# Altium schematic sheet MAX96717_PINOUT.SchDoc
size C; SheetNumber: 3; SheetTotal: 3
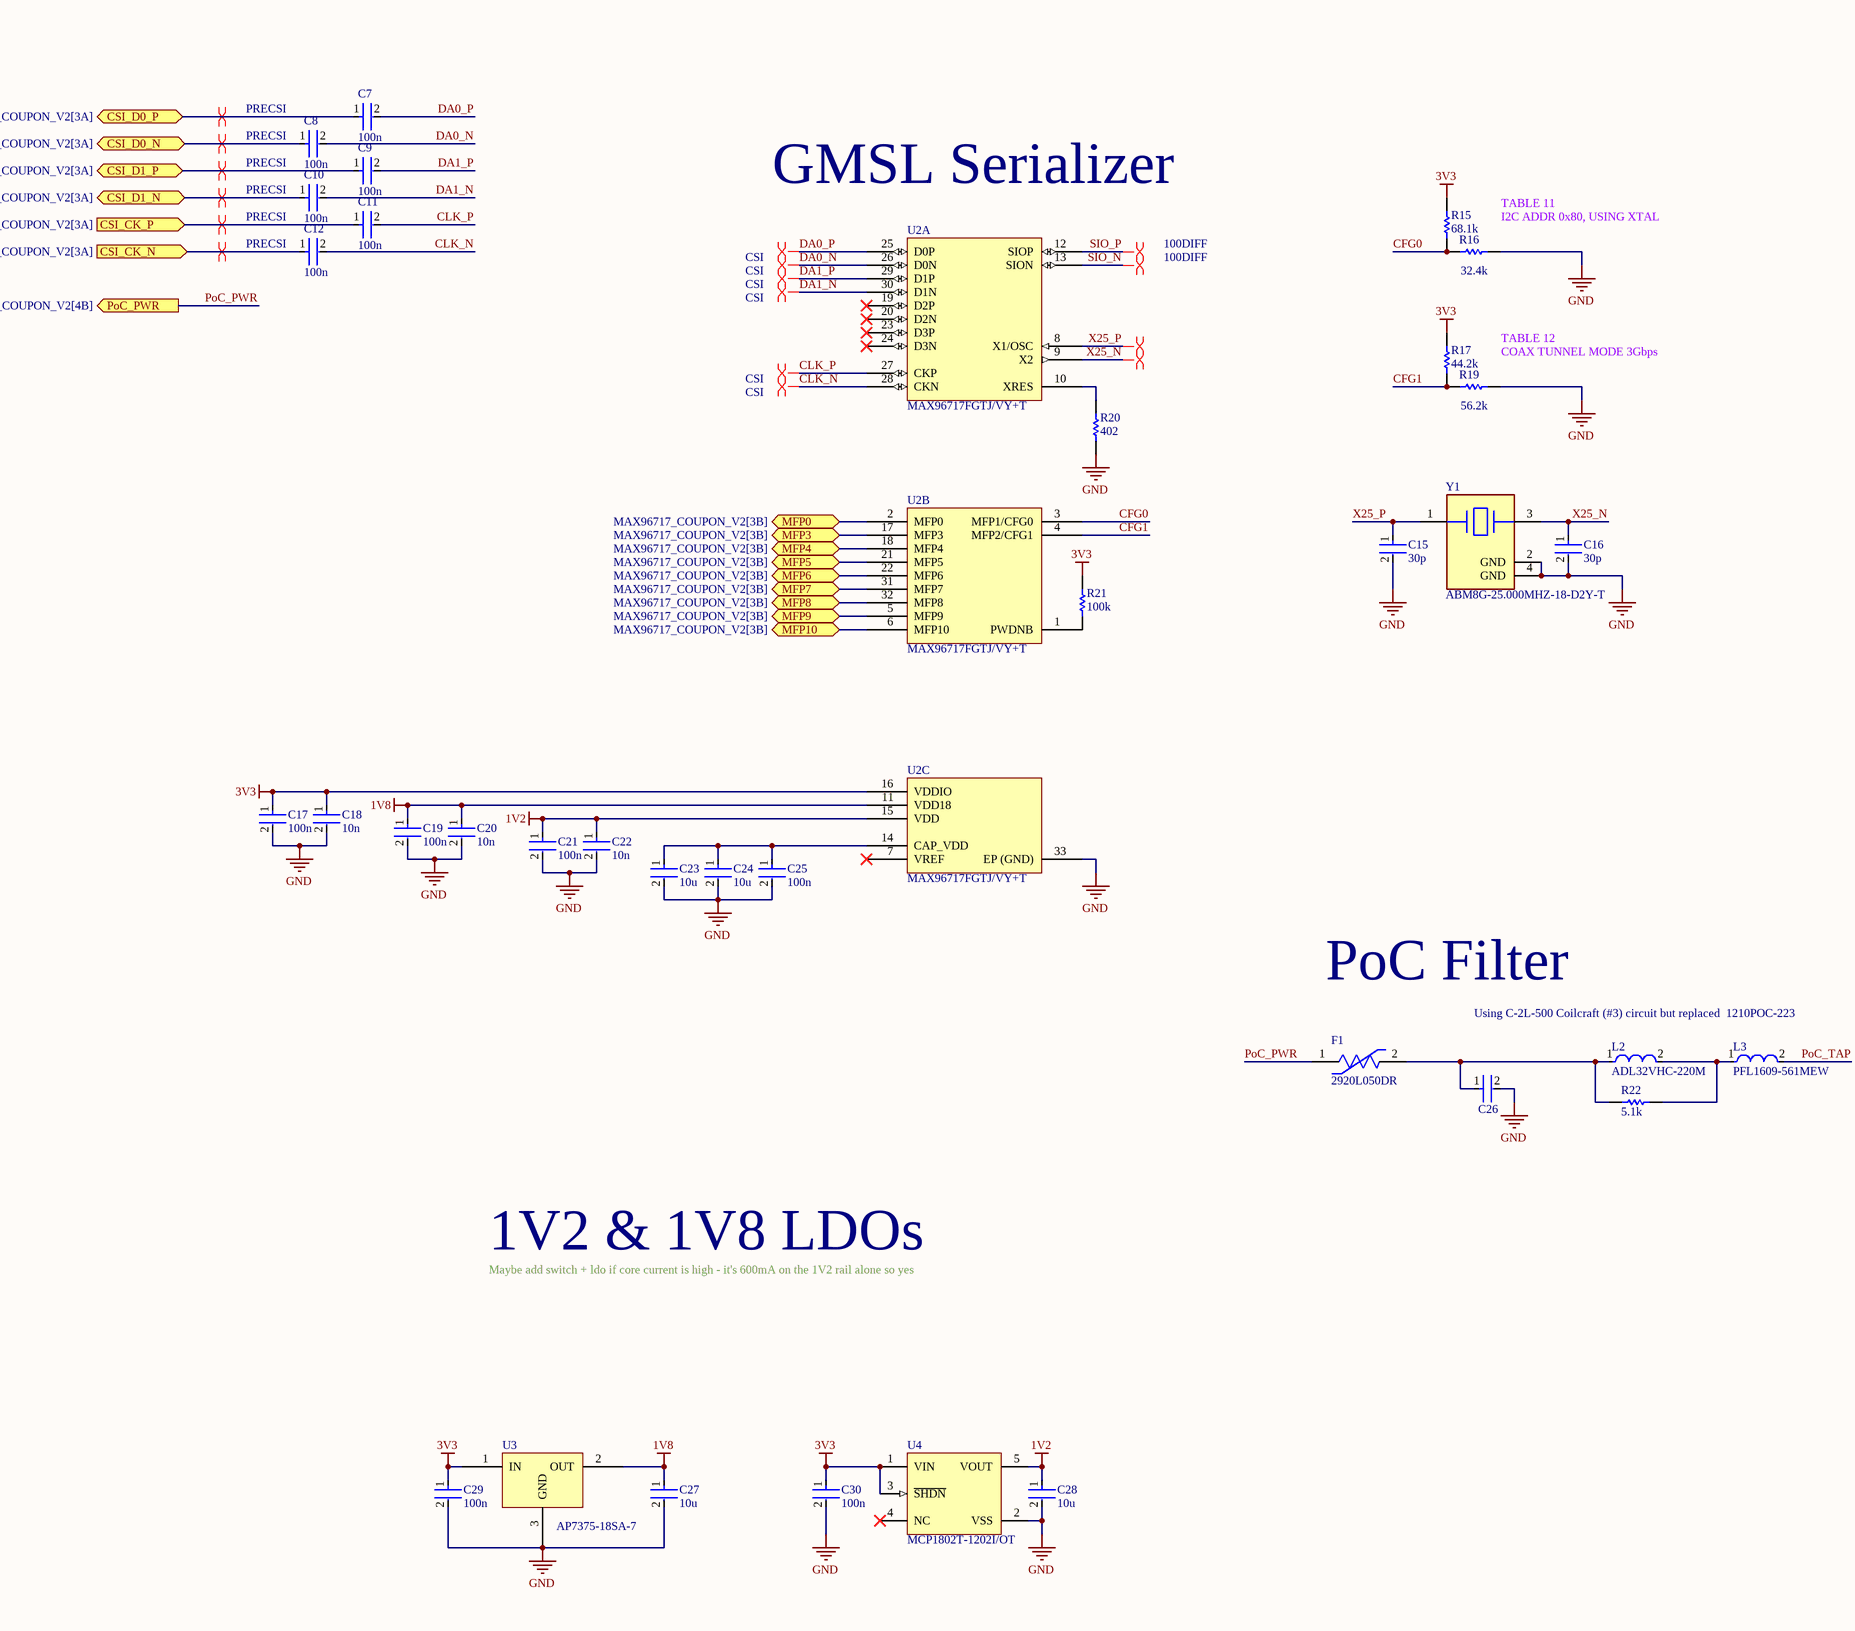
[diagram p0: MAX96717_PINOUT.SchDoc, left]
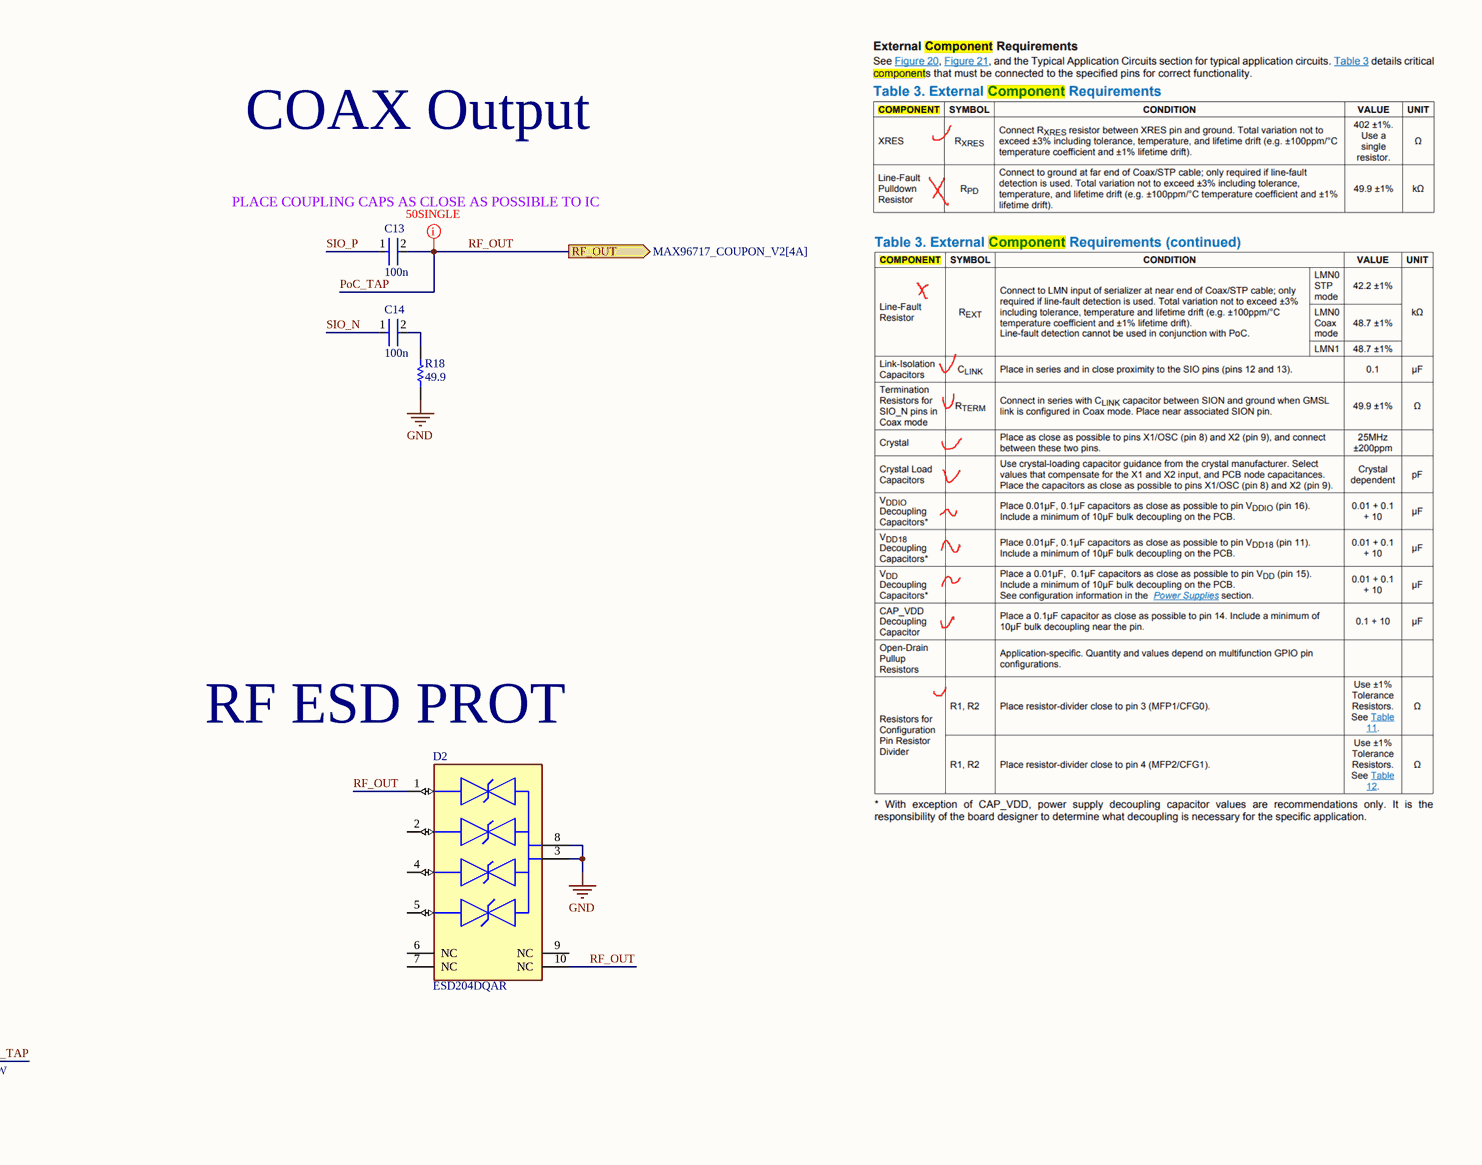
[diagram p1: MAX96717_PINOUT.SchDoc, right]

## Parts
C7  100n  [FP-0402-L_1_0_0_05-W_0_5-IPC_A]
C8  100n  [FP-0402-L_1_0_0_05-W_0_5-IPC_A]
C9  100n  [FP-0402-L_1_0_0_05-W_0_5-IPC_A]
C10  100n  [FP-0402-L_1_0_0_05-W_0_5-IPC_A]
C11  100n  [FP-0402-L_1_0_0_05-W_0_5-IPC_A]
C12  100n  [FP-0402-L_1_0_0_05-W_0_5-IPC_A]
C13  100n  [FP-0402-L_1_0_0_05-W_0_5-IPC_A]
C14  100n  [FP-0402-L_1_0_0_05-W_0_5-IPC_A]
C15  30p  [FP-0402-L_1_0_0_05-W_0_5-IPC_A]
C16  30p  [FP-0402-L_1_0_0_05-W_0_5-IPC_A]
C17  100n  [FP-0402-L_1_0_0_05-W_0_5-IPC_A]
C18  10n  [FP-0402-L_1_0_0_05-W_0_5-IPC_A]
C19  100n  [FP-0402-L_1_0_0_05-W_0_5-IPC_A]
C20  10n  [FP-0402-L_1_0_0_05-W_0_5-IPC_A]
C21  100n  [FP-0402-L_1_0_0_05-W_0_5-IPC_A]
C22  10n  [FP-0402-L_1_0_0_05-W_0_5-IPC_A]
C23  10u  [FP-0402-L_1_0_0_05-W_0_5-IPC_A]
C24  10u  [FP-0402-L_1_0_0_05-W_0_5-IPC_A]
C25  100n  [FP-0402-L_1_0_0_05-W_0_5-IPC_A]
C26  GRM21BR61E226ME44L  [FP-GRM21B-0_2-e0_2_0_7-IPC_B]  (value not drawn)
C27  10u  [FP-0402-L_1_0_0_05-W_0_5-IPC_A]
C28  10u  [FP-0402-L_1_0_0_05-W_0_5-IPC_A]
C29  100n  [FP-0402-L_1_0_0_05-W_0_5-IPC_A]
C30  100n  [FP-0402-L_1_0_0_05-W_0_5-IPC_A]
D2  ESD204DQAR  [FP-DQA0010A-MFG]
F1  2920L050DR  [FP-2920L050DR-MFG]
L2  ADL32VHC-220M  [FP-1210POC-MFG]
L3  PFL1609-561MEW  [FP-PFL1609-MFG]
R15  68.1k  [R0603B]
R16  32.4k  [R0603B]
R17  44.2k  [R0603B]
R18  49.9  [R0603B]
R19  56.2k  [R0603B]
R20  402  [R0603B]
R21  100k  [R0603B]
R22  5.1k  [R0603B]
U2  MAX96717FGTJ/VY+T  [QFN50P500X500X80_HS-33N]  (parts A,B,C of 3)
U3  AP7375-18SA-7  [AP7375-18SA-7-Footprint-1]
U4  MCP1802T-1202I/OT  [SOT-23-OT5_M]
Y1  ABM8G-25.000MHZ-18-D2Y-T  [FP-ABM8G-MFG]

## Ports
CSI_CK_N (in, see MAX96717_COUPON_V2[3A]), CSI_CK_P (in, see MAX96717_COUPON_V2[3A]), CSI_D0_N (bidir, see MAX96717_COUPON_V2[3A]), CSI_D0_P (bidir, see MAX96717_COUPON_V2[3A]), CSI_D1_N (bidir, see MAX96717_COUPON_V2[3A]), CSI_D1_P (bidir, see MAX96717_COUPON_V2[3A]), MFP0 (bidir, see MAX96717_COUPON_V2[3B]), MFP3 (bidir, see MAX96717_COUPON_V2[3B]), MFP4 (bidir, see MAX96717_COUPON_V2[3B]), MFP5 (bidir, see MAX96717_COUPON_V2[3B]), MFP6 (bidir, see MAX96717_COUPON_V2[3B]), MFP7 (bidir, see MAX96717_COUPON_V2[3B]), MFP8 (bidir, see MAX96717_COUPON_V2[3B]), MFP9 (bidir, see MAX96717_COUPON_V2[3B]), MFP10 (bidir, see MAX96717_COUPON_V2[3B]), PoC_PWR (out, see MAX96717_COUPON_V2[4B]), RF_OUT (out, see MAX96717_COUPON_V2[4A])

## Nets
1V2: C21.1 C22.1 C28.1 U2.15(VDD) U4.5(VOUT)
1V8: C19.1 C20.1 C27.1 U2.11(VDD18) U3.2(OUT)
3V3: C17.1 C18.1 C29.1 C30.1 R15.2 R17.2 R21.2 U2.16(VDDIO) U3.1(IN) U4.1(VIN) U4.3(~{SHDN})
GND: C15.2 C16.2 C17.2 C18.2 C19.2 C20.2 C21.2 C22.2 C23.2 C24.2 C25.2 C26.2 C27.2 C28.2 C29.2 C30.2 D2.3(GND) D2.8(GND) R16.1 R18.1 R19.1 R20.1 U2.33(EP_(GND)) U3.3(GND) U4.2(VSS) Y1.2(GND) Y1.4(GND)
CFG0: R15.1 R16.2 U2.3(MFP1/CFG0)
CFG1: R17.1 R19.2 U2.4(MFP2/CFG1)
CLK_N: C12.2 U2.28(CKN)
CLK_P: C11.2 U2.27(CKP)
CSI_CK_N: C12.1 ; port CSI_CK_N
CSI_CK_P: C11.1 ; port CSI_CK_P
CSI_D0_N: C8.1 ; port CSI_D0_N
CSI_D0_P: C7.1 ; port CSI_D0_P
CSI_D1_N: C10.1 ; port CSI_D1_N
CSI_D1_P: C9.1 ; port CSI_D1_P
DA0_N: C8.2 U2.26(D0N)
DA0_P: C7.2 U2.25(D0P)
DA1_N: C10.2 U2.30(D1N)
DA1_P: C9.2 U2.29(D1P)
MFP0: U2.2(MFP0) ; port MFP0
MFP3: U2.17(MFP3) ; port MFP3
MFP4: U2.18(MFP4) ; port MFP4
MFP5: U2.21(MFP5) ; port MFP5
MFP6: U2.22(MFP6) ; port MFP6
MFP7: U2.31(MFP7) ; port MFP7
MFP8: U2.32(MFP8) ; port MFP8
MFP9: U2.5(MFP9) ; port MFP9
MFP10: U2.6(MFP10) ; port MFP10
PoC_PWR: F1.1 ; port PoC_PWR
PoC_TAP: C13.2 D2.1(IO1) D2.10(NC) L3.2 ; port RF_OUT  [also labelled RF_OUT]
SIO_N: C14.1 U2.13(SION)
SIO_P: C13.1 U2.12(SIOP)
X25_N: C16.1 U2.9(X2) Y1.3
X25_P: C15.1 U2.8(X1/OSC) Y1.1
NetC14_2: C14.2 R18.2
NetC23_1: C23.1 C24.1 C25.1 U2.14(CAP_VDD)
NetC26_1: C26.1 F1.2 L2.1 R22.2
NetL2_2: L2.2 L3.1 R22.1
NetR20_2: R20.2 U2.10(XRES)
NetR21_1: R21.1 U2.1(PWDNB)

Not connected (* = marked no-connect by the designer): D2 2(IO2) 4(IO3) 5(IO4) 6(NC) 7(NC) 9(NC); U2 7(VREF)* 19(D2P)* 20(D2N)* 23(D3P)* 24(D3N)*; U4 4(NC)*

## Layout directives
differential pair: X25_N, X25_P
differential pair; differential pair class CSI: CLK_N, CLK_P, DA0_N, DA0_P, DA1_N, DA1_P
differential pair; differential pair class 100DIFF: SIO_N, SIO_P
differential pair; differential pair class PRECSI: CSI_CK_N, CSI_CK_P, CSI_D0_N, CSI_D0_P, CSI_D1_N, CSI_D1_P
net class 50SINGLE: PoC_TAP

## Notes on the sheet
- COAX Output
- GMSL Serializer
- TABLE 11
- (near C13) PLACE COUPLING CAPS AS CLOSE AS POSSIBLE TO IC
- (near R16) I2C ADDR 0x80, USING XTAL
- TABLE 12
- (near R19) COAX TUNNEL MODE 3Gbps
- RF ESD PROT
- PoC Filter
- Using C-2L-500 Coilcraft (#3) circuit but replaced  1210POC-223
- 1V2 & 1V8 LDOs
- Maybe add switch + ldo if core current is high - it's 600mA on the 1V2 rail alone so yes

## Library data of the parts
C7-C25 C27-C30 = CMP-001-00058-1: LARGE PADS, 0402 CAP, CHANGE COMMENT TO MATCH REAL P/N; Capacitor Type: Ceramic; Min Operating Temperature: -55°C; Mounting Technology: Surface Mount; Pins: 2; Case/Package: 0402; RoHS Compliant: Yes; Max Operating Temperature: 85°C
C26 = CMP-2007-03222-3: Chip Multilayer Ceramic Capacitors for General Purpose, 0805, 22uF, X5R, 15%, 20%, 25V; Case/Package: 0805; Depth: 1.25mm; Resistor Type: Ceramic; Voltage Rating: 25V; Lead Free: Lead Free; Voltage Rating (DC): 25V; Case Code (Metric): 2012; Thickness: 0.057inch; REACH SVHC: No SVHC; Material: Ceramic; Tolerance: 20%; Length: 2mm; Capacitance: 22uF; Case Code (Imperial): 0805; Max Operating Temperature: 85°C; Termination: SMD/SMT; Weight: 0.000335oz; Dielectric: X5R; Packaging: Tape and Reel; Voltage: 25V; Package Quantity: 3000; Height: 1.25mm; Mount: Surface Mount; Width: 1.25mm; Min Operating Temperature: -55°C
D2 = CMP-04989-000002-1: 4-CHANNEL LOW-CAPACITANCE SURGE; Manufacturer: Texas Instruments; Value: 0.55pF; Reverse Standoff Voltage: 3.6V; Standoff Height: 0mm; Breakdown Voltage: 5.5V; Peak Pulse Current: 5.5A; Clamping Voltage: 11.5V; Direction: Bidirectional; Peak Pulse Power: 50W; Number Of Channels: 4; Ambient Temperature Range High: +125°C; ComponentLink2Description: Datasheet; Height: 0.55mm; Lead Free: Yes; Device Class L3: unset; Temperature Range High: +125°C; Temperature Range Low: -40°C; Package: DQA0010A; Temperature: -40°C to +125°C; Capacitance: 0.55pF; RoHS: TRUE; Mouser Description: 4-Channel Low-Capacitance Surge and ESD Protection Diode 10-USON -40 to 125; Category: Diode; Device Class L1: Circuit Protection; Octopart: https://octopart.com/esd204dqar-texas+instruments-89917476; Device Class L2: TVS Diodes; Ambient Temperature Range Low: -40°C; Manufacturer Part Number: ESD204DQAR; ComponentLink2URL: http://www.ti.com/lit/ds/symlink/esd204.pdf; Automotive: No; Digikey Description: 4-CHANNEL LOW-CAPACITANCE SURGE
F1 = CMP-08606-000071-1: PTC RESET FUSE 60V 500MA 2920; Resistance: 1.4R; Trip Current: 1A; Power Dissipation: 1.5W; Time to Trip: 4s; Approvals: cULus; Current Rating: 10A; Operating Supply Voltage: 60V; Termination: SMD/SMT; Width: 5.44mm; Case/Package: 2920; Series: 2920L; Case Code (Imperial): 2920; Height: 1.25mm; Hold Current: 500mA; Terminal Material: Copper; Min Operating Temperature: -40°C; Package Quantity: 1500; Max Voltage Rating (DC): 60V; RoHS Compliant: Yes; Case Code (Metric): 7351; Lead Free: Lead Free; Max Operating Temperature: 85°C; Voltage Rating (DC): 60V; Working Voltage: 60V; Length: 7.98mm; REACH SVHC: No SVHC; Max Current Rating: 10A; Voltage Rating: 60V; Packaging: Tape and Reel
L2 = CMP-11268-000041-1: NOT COILCRAFT - ACTUAL P# --> ADL32VHC-220M / - Power Injection Chokes for PoC; Manufacturer Part Number: 1210POC-223MRC; Value: 22uH; Core Material: Ferrite; Saturation Current: 720mA; Series Resistance: 0.88Ω; Rms Current: 700mA; Automotive Grade: Grade 1; Self Resonant Frequency: 70MHz; Test Frequency: 100kHz; Tolerance: 20%; Ambient Temperature Range High: +125°C; Manufacturer: coilcraft; Octopart: https://octopart.com/1210poc-223mrc-coilcraft-103207315; Category: Ind; Device Class L2: Inductors; RoHS: TRUE; Device Class L3: Fixed Inductors; Package: 1210POC; Ambient Temperature Range Low: -40°C; ComponentLink2URL: https://drive.google.com/open?id=15FlOq8Y4YbRFohfA_cJ40jgnqs8va2Mh; Lead Free: Yes; Inductance: 22uH; Device Class L1: Passive Components; ComponentLink2Description: Datasheet; Automotive: Yes; Height: 3mm
L3 = CMP-11268-000007-1: Fixed Inductors PFL1609 Low Profile 0.56 uH 20 % 1.4 A; Manufacturer: coilcraft; Rms Current: 1100mA; Self Resonant Frequency: 600MHz; Core Material: Composite; Tolerance: 20%; Value: 0.56uH; Automotive Grade: Grade 1; Saturation Current: 710mA; Test Frequency: 7.9MHz; Shielding: true; Series Resistance: 130mΩ; Lead Free: Yes; Device Class L1: Passive Components; Package: PFL1609; Octopart: https://octopart.com/pfl1609-561mew-coilcraft-20329171; ComponentLink2URL: https://www.coilcraft.com/pdfs/pfl1609.pdf; Manufacturer Part Number: PFL1609-561MEW; Ambient Temperature Range Low: -40°C; Composition: Wirewound; Inductance: 0.56uH; Device Class L2: Inductors; Category: Ind; Device Class L3: Fixed Inductors; Mouser Description: Fixed Inductors PFL1609 Low Profile 0.56 uH 20 % 1.4 A; Automotive: Yes; ComponentLink2Description: Datasheet; Ambient Temperature Range High: +105°C; Height: 0.95mm; RoHS: TRUE
R15-R20 R22 = CMP-009-00002-14: Resistor; Value: 100k
R21 = CMP-009-00002-14: Resistor; Value: 100k
U2 = CMP-015-00012-2: 3Gbps Serializer TQFN-32 Serializers / Deserializers ROHS
U3 = CMP-019-00042-1: Fixed Positive LDO Regulator; RoHS Compliant: Yes
U4 = CMP-0136-00731-1: 300 mA, High PSRR, Low Quiescent Current LDO, 5-Pin SOT-23, Industrial Temperature, Tape and Reel; DatasheetVersion: revB, Jan-2009; PackageReference: SOT-23-OT5; Code_IPC: SOT23-5; PackageDescription: 5-Lead Plastic Small Outline Transistor (OT) [SOT-23]; PackageVersion: revBB, Aug-2009
Y1 = CMP-2000-05733-3: Crystal 25MHz ±20ppm (Tol) ±30ppm (Stability) 18pF FUND 60Ω 4-Pin SMD T/R; Series Resistance: 60R; Length: 3.2mm; Depth: 2.5mm; Packaging: Tape and Reel; Min Operating Temperature: -40°C; Operating Frequency: 25 MHz; Lead Free: Lead Free; Number of Pins: 4; Frequency Tolerance: 20ppm; Radiation Hardening: No; Max Operating Temperature: 85°C; Termination: SMD/SMT; Frequency Stability: 30ppm; Frequency: 25MHz; Series: ABM8G; Mount: Surface Mount; Package Quantity: 1000; Height: 0.039inch; Width: 0.098inch; Case/Package: CSMD; ESR (Equivalent Series Resistance): 60R; Load Capacitance: 18pF; Tolerance: 20ppm